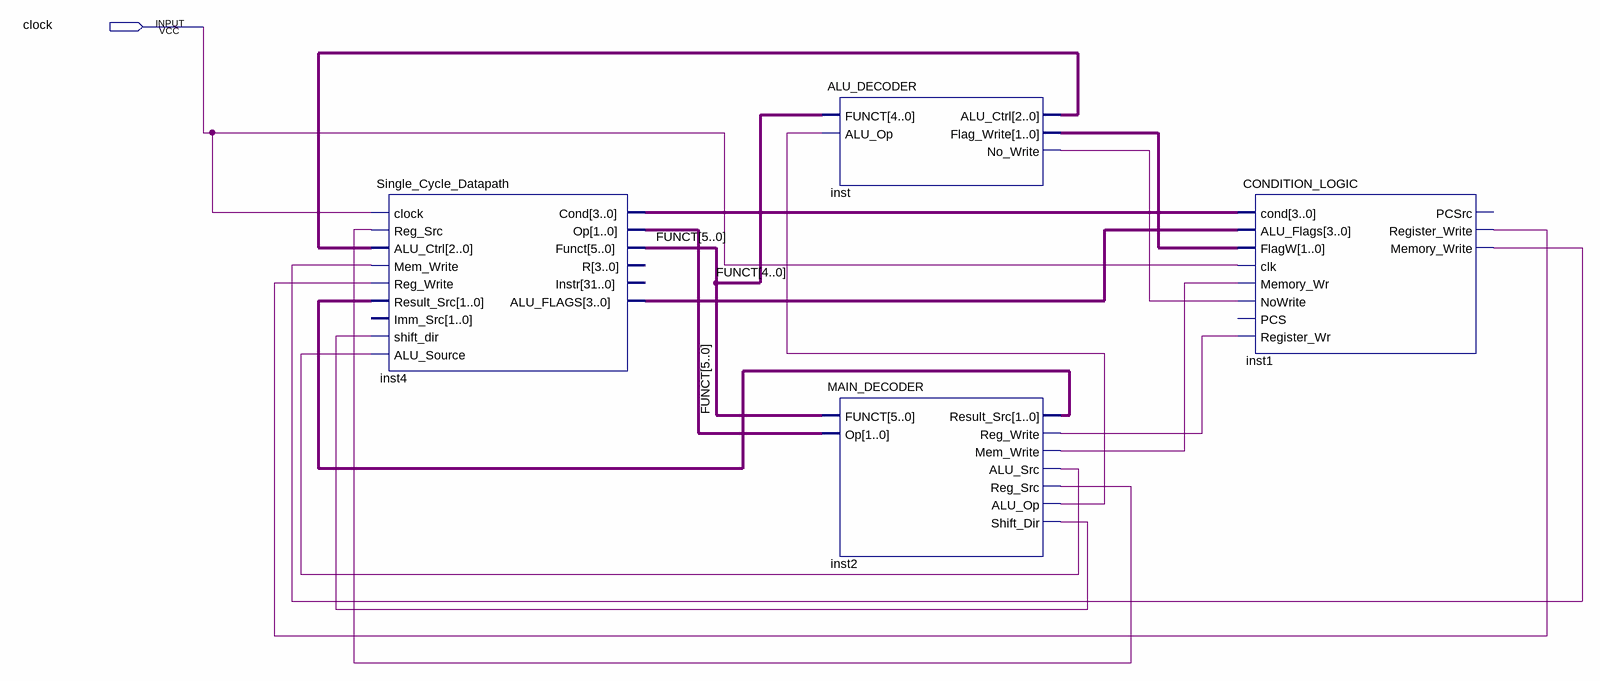
[diagram p0: schematic sheet]
// Quartus schematic Single_Cycle_CPU.bdf as structural Verilog: 4 symbols, 1 pins
module Single_Cycle_CPU (
  input  clock
);

  wire inst1_memory_write, inst1_register_write, inst2_alu_op, inst2_alu_src, inst2_mem_write, inst2_reg_src,
       inst2_reg_write, inst2_shift_dir, inst_no_write;
  wire [1:0] inst2_result_src, inst4_op, inst_flag_write;
  wire [2:0] inst_alu_ctrl;
  wire [3:0] inst4_alu_flags, inst4_cond;
  wire [5:0] FUNCT;

  Single_Cycle_Datapath inst4 (
    .clock(clock), .Reg_Src(inst2_reg_src), .ALU_Ctrl(inst_alu_ctrl), .Mem_Write(inst1_memory_write),
    .Reg_Write(inst1_register_write), .Result_Src(inst2_result_src), .shift_dir(inst2_shift_dir),
    .ALU_Source(inst2_alu_src), .Cond(inst4_cond), .Op(inst4_op), .Funct(FUNCT), .ALU_FLAGS(inst4_alu_flags));  // open: Imm_Src, R, Instr
  ALU_DECODER inst (
    .FUNCT(FUNCT[4:0]), .ALU_Op(inst2_alu_op), .ALU_Ctrl(inst_alu_ctrl), .Flag_Write(inst_flag_write),
    .No_Write(inst_no_write));
  MAIN_DECODER inst2 (
    .FUNCT(FUNCT), .Op(inst4_op), .Result_Src(inst2_result_src), .Reg_Write(inst2_reg_write),
    .Mem_Write(inst2_mem_write), .ALU_Src(inst2_alu_src), .Reg_Src(inst2_reg_src), .ALU_Op(inst2_alu_op),
    .Shift_Dir(inst2_shift_dir));
  CONDITION_LOGIC inst1 (
    .cond(inst4_cond), .ALU_Flags(inst4_alu_flags), .FlagW(inst_flag_write), .clk(clock),
    .Memory_Wr(inst2_mem_write), .NoWrite(inst_no_write), .Register_Wr(inst2_reg_write),
    .Register_Write(inst1_register_write), .Memory_Write(inst1_memory_write));  // open: PCS, PCSrc
endmodule
